# EAGLE design main (EAGLE 8.0.1)
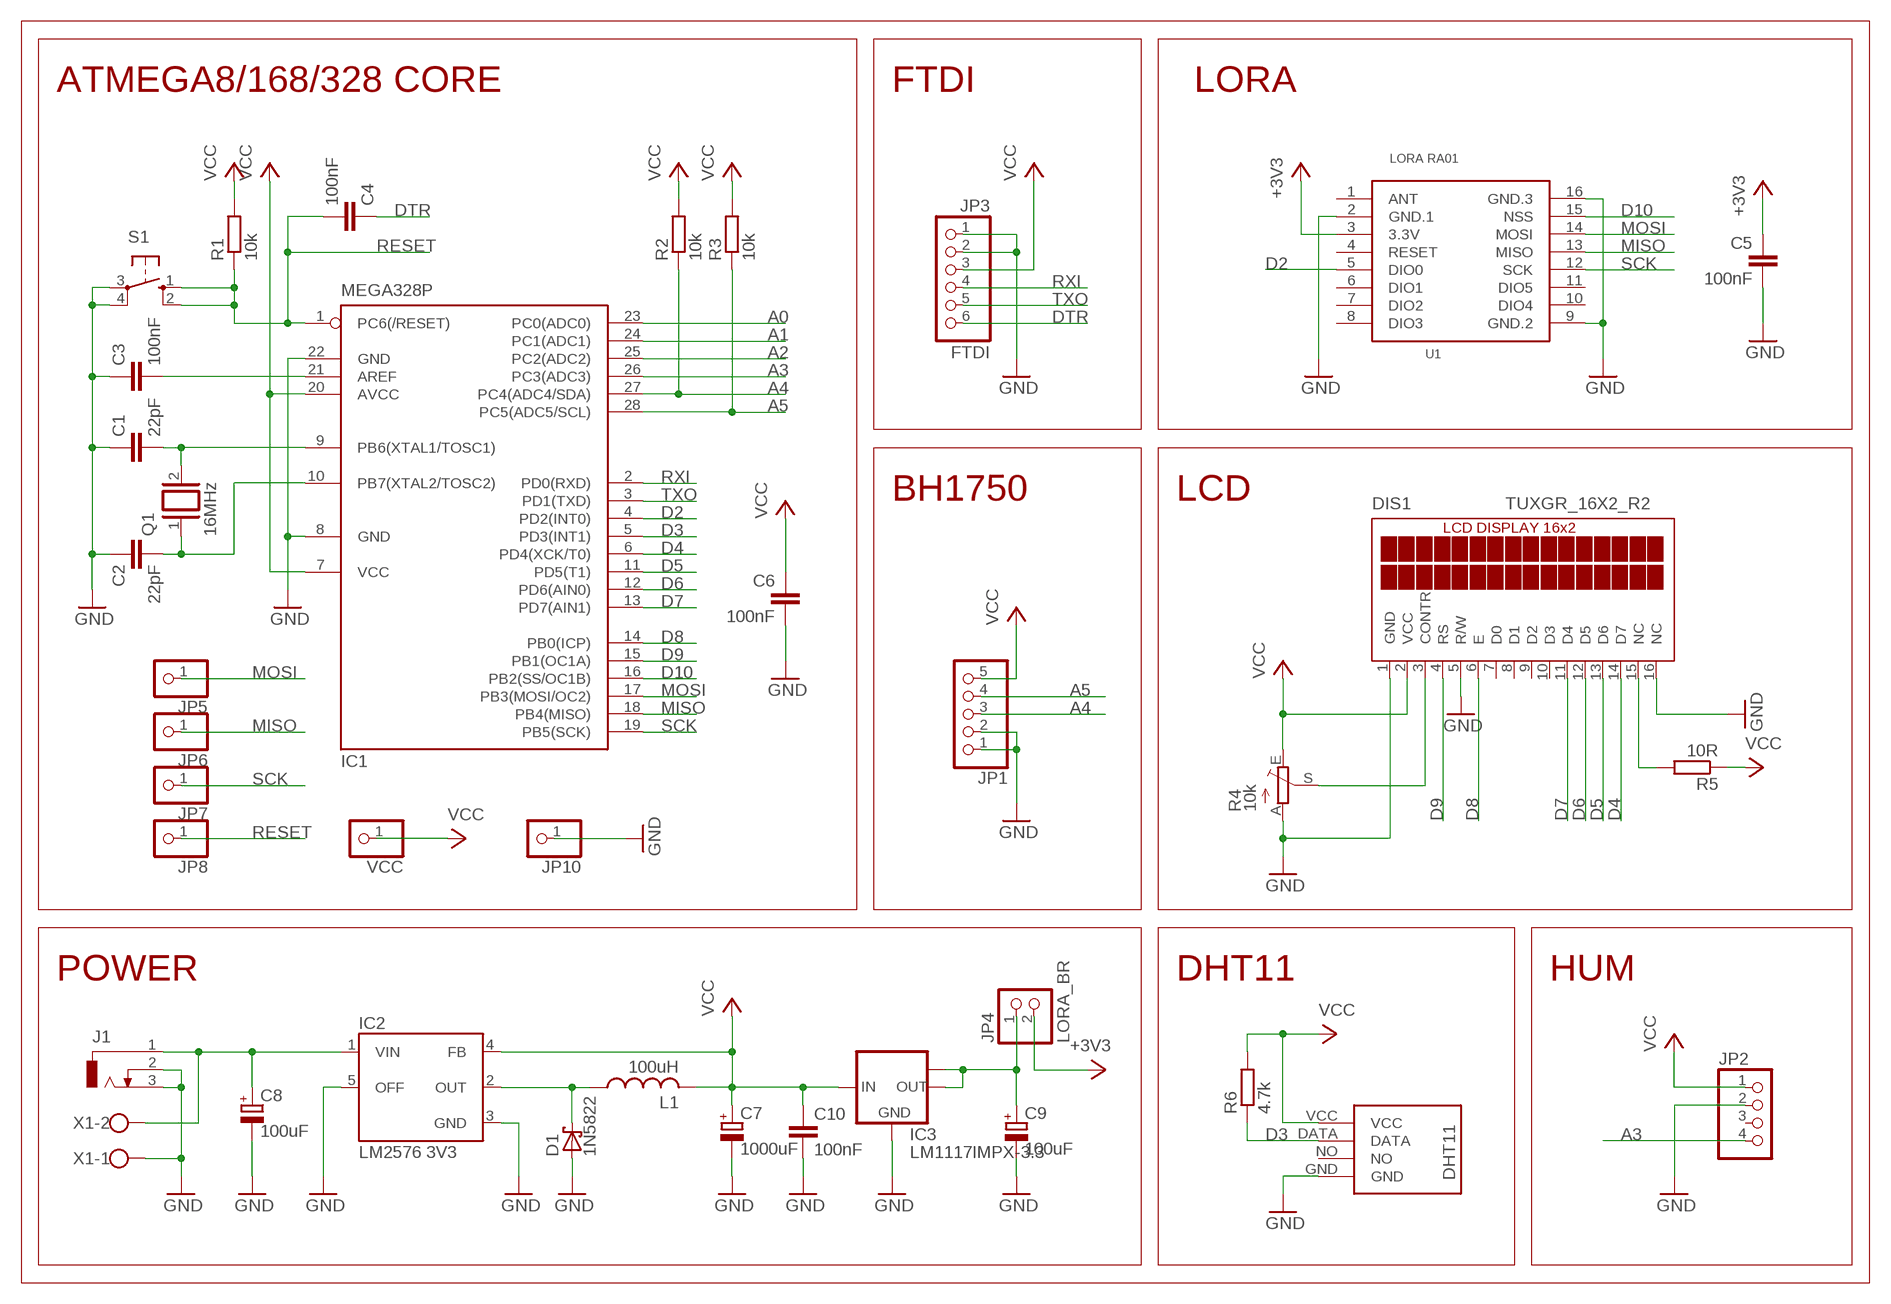
[diagram p0: schematic, sheet 1]

## Parts
C1  22pF  C-EU050-024X044  [C050-024X044]
C2  22pF  C-EU050-024X044  [C050-024X044]
C3  100nF  C-EU050-024X044  [C050-024X044]
C4  100nF  C-EU050-024X044  [C050-024X044]
C5  100nF  C-EU050-024X044  [C050-024X044]
C6  100nF  C-EU050-024X044  [C050-024X044]
C7  1000uF  CPOL-EUE5-13  [E5-13]
C8  100uF  CPOL-EUE5-8.5  [E5-8,5]
C9  100uF  CPOL-EUE3.5-10  [E3,5-10]
C10  100nF  C-EU050-024X044  [C050-024X044]
D1  1N5822  SCHOTTKY-DIODEDO201T15  [DO201T15]
DIS1  TUXGR_16X2_R2  [TUXGR_16X2_R2]
IC1  MEGA328P  MEGA8-P  [DIL28-3]
IC2  LM2576 3V3  LM2576S  [TO263-5]
IC3  LM1117IMPX-3.3  [SOT223]
J1  DCJ0303  [DCJ0303]
JP1  PINHD-1X5  [1X05]
JP2  PINHD-1X4  [1X04]
JP3  FTDI  PINHD-1X6  [1X06]
JP4  LORA_BR  PINHD-1X2  [1X02]
JP5  PINHD-1X1  [1X01]
JP6  PINHD-1X1  [1X01]
JP7  PINHD-1X1  [1X01]
JP8  PINHD-1X1  [1X01]
JP10  PINHD-1X1  [1X01]
L1  100uH  L-US6000-XXX-RC  [6000-XXXX-RC]
Q1  16MHz  XTAL/S  [QS]
R1  10k  R-EU_0207/10  [0207/10]
R2  10k  R-EU_0207/10  [0207/10]
R3  10k  R-EU_0207/10  [0207/10]
R4  10k  TRIM_EU-CA6V  [CA6V]
R5  10R  R-EU_0207/10  [0207/10]
R6  4.7k  R-EU_0207/10  [0207/10]
S1  10-XX  [B3F-10XX]
U1  LORA RA01  LORA-RA-01-433MHZ  [LORA-RA1-SMD]
U$1  DHT11-PION.  [DHT11-PION.]
VCC  PINHD-1X1  [1X01]
X1  W237-102  [W237-102]

## Nets
+3V3: C5.1 JP4.2 U1.3(3.3V)
A0: IC1.23(PC0(ADC0))
A1: IC1.24(PC1(ADC1))
A2: IC1.25(PC2(ADC2))
A3: IC1.26(PC3(ADC3)) JP2.4
A4: IC1.27(PC4(ADC4/SDA)) JP1.3 R2.1
A5: IC1.28(PC5(ADC5/SCL)) JP1.4 R3.1
D2: IC1.4(PD2(INT0)) U1.5(DIO0)
D3: IC1.5(PD3(INT1)) R6.1 U$1.DATA
D4: DIS1.14(D7) IC1.6(PD4(XCK/T0))
D5: DIS1.13(D6) IC1.11(PD5(T1))
D6: DIS1.12(D5) IC1.12(PD6(AIN0))
D7: DIS1.11(D4) IC1.13(PD7(AIN1))
D8: DIS1.6(E) IC1.14(PB0(ICP))
D9: DIS1.4(RS) IC1.15(PB1(OC1A))
D10: IC1.16(PB2(SS/OC1B)) U1.15(NSS)
DTR: C4.1 JP3.6
GND: C1.1 C2.1 C3.1 C5.2 C6.2 C7.- C8.- C9.- C10.2 D1.A DIS1.1(GND) DIS1.5(R/W) DIS1.16(NC) IC1.8(GND) IC1.22(GND) IC2.3(GND) IC2.5(OFF) IC3.1(GND) J1.2 J1.3 JP1.1 JP1.2 JP2.2 JP3.1 JP3.2 JP10.1 R4.A S1.3(P) S1.4(P1) U1.2(GND.1) U1.9(GND.2) U1.16(GND.3) U$1.GND X1.1
MISO: IC1.18(PB4(MISO)) JP6.1 U1.13(MISO)
MOSI: IC1.17(PB3(MOSI/OC2)) JP5.1 U1.14(MOSI)
N$5: C1.2 IC1.9(PB6(XTAL1/TOSC1)) Q1.2
N$6: C2.2 IC1.10(PB7(XTAL2/TOSC2)) Q1.1
N$8: C3.2 IC1.21(AREF)
N$9: C8.+ IC2.1(VIN) J1.1 X1.2
N$10: D1.C IC2.2(OUT) L1.1
N$11: C9.+ IC3.2(OUT) IC3.TAB(OUT1) JP4.1
N$16: DIS1.15(NC) R5.2
N$17: DIS1.3(CONTR) R4.S
RESET: C4.2 IC1.1(PC6(/RESET)) JP8.1 R1.1 S1.1(S) S1.2(S1)
RXI: IC1.2(PD0(RXD)) JP3.4
SCK: IC1.19(PB5(SCK)) JP7.1 U1.12(SCK)
TXO: IC1.3(PD1(TXD)) JP3.5
VCC: C6.1 C7.+ C10.1 DIS1.2(VCC) IC1.7(VCC) IC1.20(AVCC) IC2.4(FB) IC3.3(IN) JP1.5 JP2.1 JP3.3 L1.2 R1.2 R2.2 R3.2 R4.E R5.1 R6.2 U$1.VCC VCC.1
Unconnected: DIS1.7(D0) DIS1.8(D1) DIS1.9(D2) DIS1.10(D3) JP2.3 U1.1(ANT) U1.4(RESET) U1.6(DIO1) U1.7(DIO2) U1.8(DIO3) U1.10(DIO4) U1.11(DIO5) U$1.NO

## Notes on the sheet
- ATMEGA8/168/328 CORE | FTDI | LORA
- BH1750 | LCD
- POWER | DHT11 | HUM

## Library data of the parts
C1-C6 C10 = rcl:C-EU: CAPACITOR, European symbol
C7-C9 = rcl:CPOL-EU: POLARIZED CAPACITOR, European symbol
D1 = diode:SCHOTTKY-DIODE: Schottky Diode
DIS1 = display-lcd:TUXGR_16X2_R2: Tuxgraphics LCD display 16x2 characters reflective, without background light Source: tuxgr_12x2_r2.pdf; OC_FARNELL: unknown; OC_NEWARK: unknown
IC1 = atmel:MEGA8-P: MICROCONTROLLER 8 Kbytes FLASH, 1 kbytes SRAM, 512 bytes EEPROM, USART, 4-channel 10 bit ADC, 2-channel 8 bit ADC Pin compatible with Atmega48, ATMega88, ATMega168 Source: avr.lbr; OC_FARNELL: unknown; OC_NEWARK: unknown
IC2 = lm2576:LM2576: National Semiconductor <http://www.national.com> 3.0A "Simple Switcher"(c) 52kHz, Vout 1.23-37V (HV: 57V), Vin 40V (HV: 60V), 50µA standby current
IC3 = lm1117:LM1117IMPX-*
J1 = con-jack:DCJ0303: DC POWER JACK Source: DCJ0303.pdf; OC_FARNELL: unknown; OC_NEWARK: unknown
JP1 = pinhead:PINHD-1X5: PIN HEADER
JP2 = pinhead:PINHD-1X4: PIN HEADER
JP3 = pinhead:PINHD-1X6: PIN HEADER
JP4 = pinhead:PINHD-1X2: PIN HEADER
JP5-JP8 JP10 VCC = pinhead:PINHD-1X1: PIN HEADER
L1 = rcl:L-US: INDUCTOR, American symbol
Q1 = special:XTAL/S: CRYSTAL
R1-R3 R5 R6 = rcl:R-EU_: RESISTOR, European symbol
R4 = pot:TRIM_EU-: POTENTIOMETER
S1 = switch-omron:10-XX: OMRON SWITCH; MPN: B3F-1000; OC_FARNELL: 176432; OC_NEWARK: 36M3542
U1 = lora:LORA-RA-01-433MHZ: 433 MHz Lora Ra-01 Radio Transceiver Module based on SX1278 chip.
U$1 = dht11:DHT11-PION.: DHT11 Czujnik temperatury i wilgotności (widok pionowy)
X1 = con-wago-500:W237-102: WAGO SCREW CLAMP; MPN: 237-102; OC_FARNELL: unknown; OC_NEWARK: 70K9898

## Board
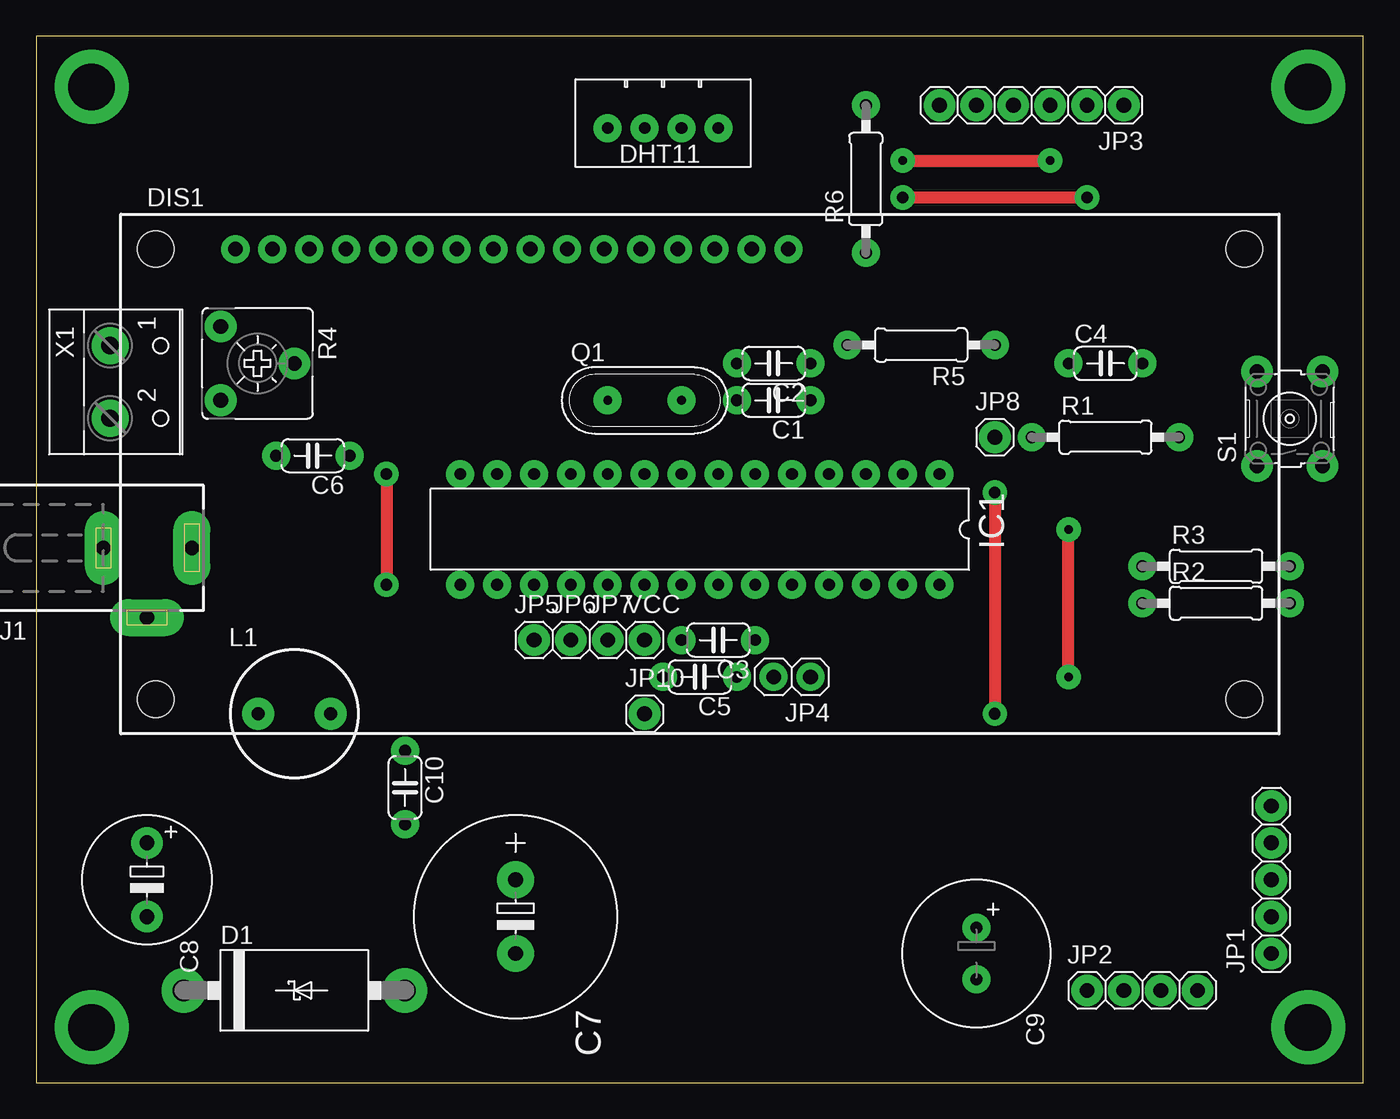
[diagram p1: board, top side]
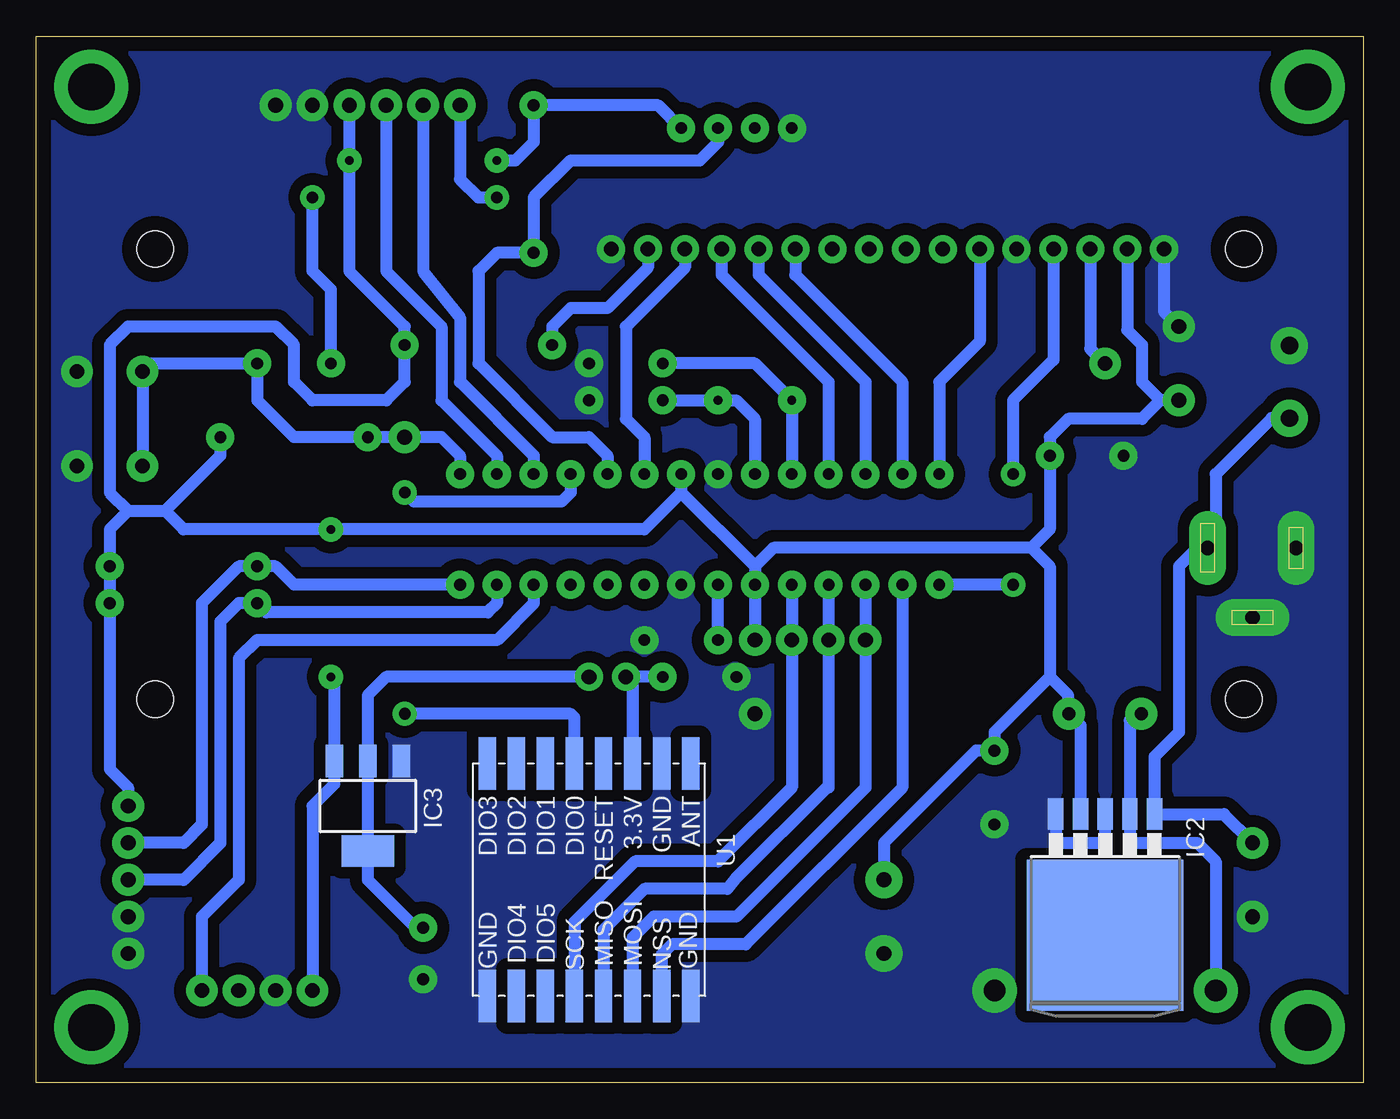
[diagram p2: board, bottom side, seen from below]

Size 91.42 x 72.06 mm. Coordinates in mm from the lower left corner, seen from the top.
Outline: 0,0 91.42,0 91.42,72.06 0,72.06 0,0
Copper layers (1*16): Top 0.035mm / dielectric 1.5mm / Bottom 0.035mm
Design rules "default": minimum track width 10mil, minimum drill 24mil, track to track 8mil, track to pad 8mil, pad to pad 8mil, via to via 8mil, smd to smd 8mil, copper to edge 40mil, drill to drill 8mil, minimum pad ring 10mil, minimum via ring 8mil, stop-mask expansion 4mil, vias tented up to drill 0mil, thermal gap 10mil

### Footprints (pad centres in the part's own frame; a part is rotated, then mirrored left to right if it is on the bottom)
C050-024X044 = drill 0.813 pad 1.93: 1 -2.54,0; 2 2.54,0
E5-13 = drill 1.016 pad 2.54: + -2.54,0; - 2.54,0
E5-8,5 = drill 1.016 pad 2.184: + -2.54,0; - 2.54,0
E3,5-10 = drill 0.813 pad 1.93: + -1.778,0; - 1.778,0
DO201T15 = drill 1.499 pad 3.048: A 7.62,0; C -7.62,0
TUXGR_16X2_R2 = drill 1 pad 1.93: 1 -32,15.5; 2 -29.46,15.5; 3 -26.92,15.5; 4 -24.38,15.5; 5 -21.84,15.5; 6 -19.3,15.5; 7 -16.76,15.5; 8 -14.22,15.5; 9 -11.68,15.5; 10 -9.14,15.5; 11 -6.6,15.5; 12 -4.06,15.5; 13 -1.52,15.5; 14 1.02,15.5; 15 3.56,15.5; 16 6.1,15.5 | hole 2.5: -37.5,-15.5; 37.5,-15.5; -37.5,15.5; 37.5,15.5
DIL28-3 = drill 0.813 pad 1.93: 1 -16.51,-3.81; 2 -13.97,-3.81; 3 -11.43,-3.81; 4 -8.89,-3.81; 5 -6.35,-3.81; 6 -3.81,-3.81; 7 -1.27,-3.81; 8 1.27,-3.81; 9 3.81,-3.81; 10 6.35,-3.81; 11 8.89,-3.81; 12 11.43,-3.81; 13 13.97,-3.81; 14 16.51,-3.81; 15 16.51,3.81; 16 13.97,3.81; 17 11.43,3.81; 18 8.89,3.81; 19 6.35,3.81; 20 3.81,3.81; 21 1.27,3.81; 22 -1.27,3.81; 23 -3.81,3.81; 24 -6.35,3.81; 25 -8.89,3.81; 26 -11.43,3.81; 27 -13.97,3.81; 28 -16.51,3.81
TO263-5 = smd 1.067 x 2.159: 1 -3.404,-5.791; 2 -1.702,-5.791; 3 0,-5.791; 4 1.702,-5.791; 5 3.404,-5.791 | smd 10.8 x 10.41: 6 0,2.54
SOT223 = smd 1.219 x 2.235: 1 -2.311,-3.099; 2 0,-3.099; 3 2.311,-3.099 | smd 3.6 x 2.2: TAB 0,3.099
DCJ0303 = drill 1 pad 2.54 long: 1 0,3.1; 2 4.8,0; 3 0,-3
1X05 = drill 1.016 pad 2.184: 1 -5.08,0; 2 -2.54,0; 3 0,0; 4 2.54,0; 5 5.08,0
1X04 = drill 1.016 pad 2.184: 1 -3.81,0; 2 -1.27,0; 3 1.27,0; 4 3.81,0
1X06 = drill 1.016 pad 2.184: 1 -6.35,0; 2 -3.81,0; 3 -1.27,0; 4 1.27,0; 5 3.81,0; 6 6.35,0
1X02 = drill 1.016 pad 1.93: 1 -1.27,0; 2 1.27,0
1X01 = drill 1.016 pad 2.184: 1 0,0
6000-XXXX-RC = drill 0.9 pad 2.184: 1 -2.5,0; 2 2.5,0
QS = drill 0.61 pad 1.93: 1 -2.54,0; 2 2.54,0
0207/10 = drill 0.813 pad 1.93: 1 -5.08,0; 2 5.08,0
CA6V = drill 1.016 pad 2.184: A -2.54,-2.54; E 2.54,-2.54; S 0,2.54
B3F-10XX = drill 1.016 pad 2.184: 1 -3.251,2.261; 2 3.251,2.261; 3 -3.251,-2.261; 4 3.251,-2.261
LORA-RA1-SMD = smd 3.6 x 1.2: 1 -8,7; 2 -8,5; 3 -8,3; 4 -8,1; 5 -8,-1; 6 -8,-3; 7 -8,-5; 8 -8,-7; 9 8,-7; 10 8,-5; 11 8,-3; 12 8,-1; 13 8,1; 14 8,3; 15 8,5; 16 8,7
DHT11-PION. = drill 0.8 pad 1.93: DATA -1.27,0.305; GND 3.81,0.305; NO 1.27,0.305; VCC -3.81,0.305
W237-102 = drill 1.194 pad 2.54: 1 -2.5,-1.27; 2 2.5,-1.27

### Placement (x,y rotation side)
C1  50.8,46.99 180 top
C2  50.8,49.53 180 top
C3  46.99,30.48 180 top
C4  73.66,49.53 0 top
C5  45.72,27.94 180 top
C6  19.05,43.18 180 top
C7  33.02,11.43 270 top
C8  7.62,13.97 270 top
C9  64.77,8.89 270 top
C10  25.4,20.32 270 top
D1  17.78,6.35 0 top
DIS1  45.72,41.91 0 top
IC1  45.72,38.1 180 top
IC2  17.78,12.7 180 bottom
IC3  68.58,19.05 180 bottom
J1  7.62,36.83 270 top
JP1  85.09,13.97 90 top
JP2  76.2,6.35 0 top
JP3  68.58,67.31 180 top
JP4  52.07,27.94 180 top
JP5  34.29,30.48 0 top
JP6  36.83,30.48 0 top
JP7  39.37,30.48 0 top
JP8  66.04,44.45 0 top
JP10  41.91,25.4 0 top
L1  17.78,25.4 0 top
Q1  41.91,46.99 0 top
R1  73.66,44.45 0 top
R2  81.28,33.02 0 top
R3  81.28,35.56 0 top
R4  15.24,49.53 270 top
R5  60.96,50.8 180 top
R6  57.15,62.23 90 top
S1  86.36,45.72 90 top
U1  53.34,13.97 270 bottom
U$1  43.18,66.04 180 top
VCC  41.91,30.48 0 top
X1  6.35,48.26 270 top

### Tracks (layer width: path | path; a pad name or v marks a point on that pad's centre or on a via)
+3V3
  Bottom 0.813: U1.3 50.34,27.48 JP4.2 C5.1
A3
  Bottom 0.813: IC1.26 57.15,33.02 59.69,30.48 76.2,30.48 77.47,29.21 77.47,13.97 80.01,11.43 JP2.4
A4
  Bottom 0.813: IC1.27 59.69,33.02 60.33,32.38 75.56,32.38 R2.1 77.47,33.02 78.74,31.75 78.74,16.51 81.28,13.97 JP1.3
A5
  Bottom 0.813: IC1.28 73.66,34.29 74.93,35.56 R3.1 77.47,35.56 80.01,33.02 80.01,17.78 81.28,16.51 JP1.4
D2  (via drill 0.8 pad 1.68)
  Top 0.813: v66.04,40.64 v66.04,25.4
  Bottom 0.813: IC1.4 54.61,40.64 55.24,40.01 65.41,40.01 v66.04,40.64 | U1.5 54.34,25.13 54.61,25.4 v66.04,25.4
D3
  Bottom 0.813: IC1.5 52.07,43.18 53.34,44.45 55.88,44.45 60.96,49.53 60.96,55.88 59.69,57.15 R6.1 57.15,60.96 54.61,63.5 45.72,63.5 44.45,64.77 U$1.DATA
D4
  Bottom 0.813: DIS1.14 46.74,56.13 50.8,52.07 50.8,45.72 49.53,44.45 IC1.6
D5
  Bottom 0.813: DIS1.13 44.2,55.63 36.83,48.26 IC1.11
D6
  Bottom 0.813: DIS1.12 41.66,55.63 34.29,48.26 IC1.12
D7
  Bottom 0.813: DIS1.11 39.12,55.63 31.75,48.26 IC1.13
D8
  Bottom 0.813: DIS1.6 26.42,51.05 29.21,48.26 IC1.14
D9  (via drill 0.8 pad 1.68)
  Top 0.813: v24.13,41.91 v24.13,34.29
  Bottom 0.813: DIS1.4 21.34,49.78 24.13,46.99 v24.13,41.91 | v24.13,34.29 IC1.15
D10
  Bottom 0.813: IC1.16 31.75,20.32 42.55,9.53 47.62,9.53 48.34,8.81 U1.15
DTR  (via drill 0.8 pad 1.68)
  Top 0.813: v59.69,60.96 v72.39,60.96
  Bottom 0.813: JP3.6 62.23,62.23 60.96,60.96 v59.69,60.96 | v72.39,60.96 72.39,55.88 71.12,54.61 C4.1
GND
  Bottom 0.813: DIS1.1 13.72,53.09 R4.A | IC2.3 17.78,16.51 21.18,16.51 IC2.5
  pour Bottom (isolate 0.813, no thermals): 0,72.39 91.44,72.39 91.44,0 0,0
MISO
  Bottom 0.813: U1.13 52.34,10.53 49.53,13.34 43.81,13.34 43.25,14.03 36.96,20.32 36.83,20.32 JP6.1 IC1.18
MOSI
  Bottom 0.813: U1.14 50.34,9.98 48.9,11.43 43.18,11.43 34.29,20.32 JP5.1 IC1.17
N$2  (via drill 3.2 pad 5.08)
  other vias: 3.81,3.81
N$3  (via drill 3.2 pad 5.08)
  other vias: 87.63,3.81
N$4  (via drill 3.2 pad 5.08)
  other vias: 3.81,68.58
N$5
  Bottom 0.813: IC1.9 41.91,45.72 43.18,46.99 Q1.2 C1.2
N$6
  Bottom 0.813: IC1.10 Q1.1 41.91,49.53 C2.2
N$7  (via drill 3.2 pad 5.08)
  other vias: 87.63,68.58
N$8
  Bottom 0.813: C3.2 IC1.21
N$9
  Bottom 0.813: C8.+ 9.6,18.49 IC2.1 14.38,22.45 12.7,24.13 12.7,35.56 11.43,36.83 J1.1 10.16,37.39 10.16,41.91 6.31,45.76 X1.2
N$10
  Bottom 0.813: L1.1 16.08,24.93 IC2.2 16.08,16.51 11.43,16.51 10.16,15.24 D1.C
N$11
  Bottom 0.813: JP4.1 67.31,27.94 68.58,26.67 IC3.2 IC3.TAB 68.58,13.97 65.28,10.67 C9.+
N$16
  Bottom 0.813: DIS1.15 49.28,56.13 52.07,53.34 54.61,53.34 55.88,52.07 R5.2
N$17
  Bottom 0.813: DIS1.3 18.8,50.55 R4.S
RESET
  Bottom 0.813: S1.1 S1.2 83.54,49.53 C4.2 76.2,46.99 73.66,44.45 R1.1 JP8.1 63.5,44.45 62.23,43.18 IC1.1
RXI
  Bottom 0.813: JP3.4 67.31,55.88 63.5,52.07 63.5,46.99 59.69,43.18 IC1.2
SCK
  Bottom 0.813: U1.12 54.34,11.06 50.16,15.24 44.45,15.24 39.37,20.32 JP7.1 IC1.19
TXO
  Bottom 0.813: JP3.5 64.77,55.88 62.23,52.7 62.23,48.26 57.15,43.18 IC1.3
VCC  (via drill 0.6 pad 1.68)
  Top 0.813: v59.69,63.5 v69.85,63.5 | v71.12,27.94 v71.12,38.1
  Bottom 0.813: 41.91,35.56 46.99,40.64 | 41.91,35.56 40.64,36.83 22.86,36.83 | 22.86,36.83 21.59,35.56 21.59,27.94 | IC2.4 19.48,24.6 L1.2 20.32,26.67 21.59,27.94 | DIS1.2 16.26,51.82 15.24,50.8 15.24,48.26 13.97,46.99 | R4.E 13.97,46.99 | 13.97,46.99 15.24,45.72 20.32,45.72 21.59,44.45 C6.1 21.59,38.1 22.86,36.83 | JP3.3 v69.85,63.5 69.85,55.88 66.04,52.07 R5.1 66.04,48.26 67.31,46.99 72.39,46.99 73.66,48.26 73.66,50.8 74.93,52.07 85.09,52.07 86.36,50.8 86.36,40.64 85.09,39.37 | 21.59,27.94 25.4,24.13 C10.1 26.67,22.86 33.02,16.51 C7.+ | IC1.7 46.99,40.64 | 41.91,35.56 IC1.20 VCC.1 | R1.2 78.74,43.18 82.55,39.37 | 85.09,39.37 82.55,39.37 | 85.09,39.37 86.36,38.1 R3.2 R2.2 86.36,21.59 85.09,20.32 JP1.5 | 46.99,40.64 49.53,38.1 v71.12,38.1 81.28,38.1 82.55,39.37 | v59.69,63.5 58.42,63.5 57.15,64.77 R6.2 48.56,67.31 U$1.VCC | v71.12,27.94 70.89,27.71 IC3.3 70.89,20.55 72.39,19.05 JP2.1